# EAGLE design TempestShocker (EAGLE 6.6.0)

## Sheet 1 of 3
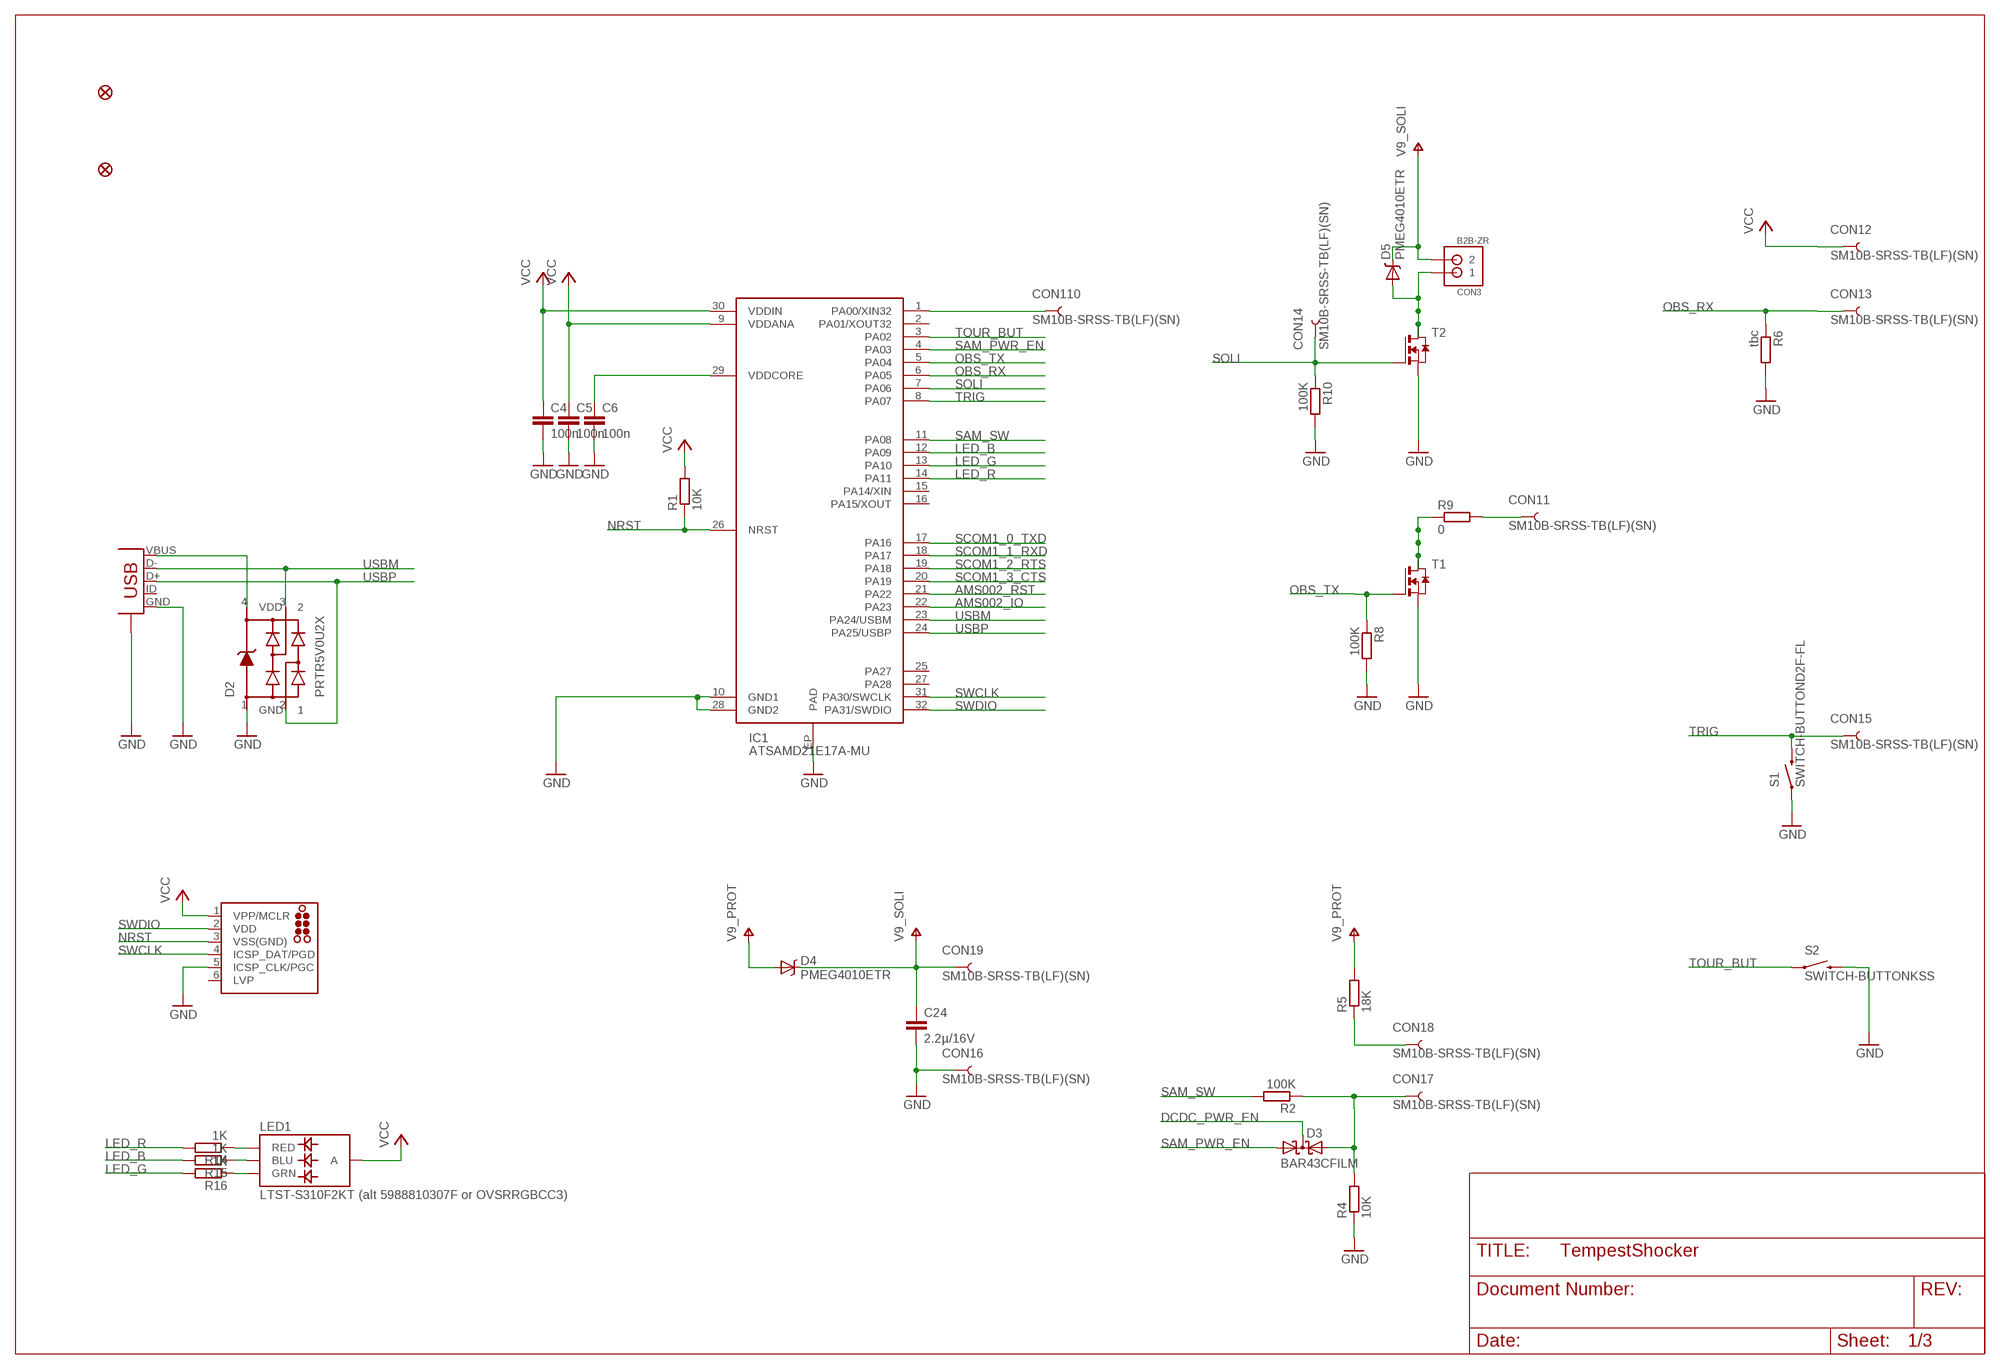
[diagram p0: schematic, sheet 1]

### Parts
C4  100n  C0603  [_0603MP]
C5  100n  C0603  [_0603MP]
C6  100n  C0603  [_0603MP]
C24  2.2µ/16V  C-EUC0805  [C0805]
CON1  SM10B-SRSS-TB(LF)(SN)  [SM10B-SRSS-TB]
CON3  B2B-ZR  [S2B-ZR]
CON4  USB-MICRO-A  [USB-MICROB]
D2  PRTR5V0U2X  WE-TVS_824011B  [AUTOPILOT_SOT143B]
D3  BAR43CFILM  BAT54C  [SOT23]
D4  PMEG4010ETR  DIODE-SCHOTTKYSOD123  [SOD123]
D5  PMEG4010ETR  DIODE-SCHOTTKYSOD123  [SOD123]
FID1  FIDUCIALUFIDUCIAL  [MICRO-FIDUCIAL]
FID6  FIDUCIALUFIDUCIAL  [MICRO-FIDUCIAL]
IC1  ATSAMD21E17A-MU  ATSAMD21E  [QFN-32]
LED1  LTST-S310F2KT (alt 5988810307F or OVSRRGBCC3)  LED-TRICOLORSMD_SIDE  [RGB-LED-SMD-SIDE]
R1  10K  R0603  [_0603MP]
R2  100K  R0603  [_0603MP]
R4  10K  R0603  [_0603MP]
R5  18K  R0603  [_0603MP]
R6  tbc  R0603  [_0603MP]
R8  100K  R0603  [_0603MP]
R9  0  R0603  [_0603MP]
R10  100K  R0603  [_0603MP]
R14  1K  R0603  [_0603MP]
R15  1K  R0603  [_0603MP]
R16  1K  R0603  [_0603MP]
S1  SWITCH-BUTTOND2F-FL  [D2F-FL]
S2  SWITCH-BUTTONKSS  [KSS]
T1  NMOSSOT23-6  [SOT23-6]
T2  NMOSSOT23-6  [SOT23-6]
TC2030-CTX-NL  dnp  TC2030-MCP-NL  [TC2030-MCP-NL]

### Nets
AMS002_IO: IC1.22(PA23) ; also sheet 2
AMS002_RST: IC1.21(PA22) ; also sheet 2
DCDC_PWR_EN: D3.3(CC) ; also sheet 3
GND: C4.2 C5.2 C6.2 C24.2 CON1.6 CON4.GND CON4.GND@1(GND) D2.1(GND) IC1.10(GND1) IC1.28(GND2) IC1.EP(PAD) R4.1 R6.2 R8.2 R10.2 S1.COM S2.2 T1.4(S) T2.4(S) TC2030-CTX-NL.5(ICSP_CLK/PGC) ; also sheet 2,3
LED_B: IC1.12(PA09) R15.2
LED_G: IC1.13(PA10) R16.2
LED_R: IC1.14(PA11) R14.2
N$1: CON1.10 IC1.1(PA00/XIN32)
N$2: C6.1 IC1.29(VDDCORE)
N$3: CON3.1 D5.A T2.1(D) T2.2(D1) T2.5(D2) T2.6(D3)
N$4: CON4.VBUS D2.4(VDD)
N$5: CON1.7 D3.2(A2) R2.1 R4.2
N$6: R9.1 T1.1(D) T1.2(D1) T1.5(D2) T1.6(D3)
N$7: CON1.8 R5.1
N$8: CON1.1 R9.2
N$30: LED1.1(RED) R14.1
N$31: LED1.3(BLU) R15.1
N$32: LED1.2(GRN) R16.1
NRST: IC1.26(NRST) R1.1 TC2030-CTX-NL.3(VSS(GND))
OBS_RX: CON1.3 IC1.6(PA05) R6.1
OBS_TX: IC1.5(PA04) R8.1 T1.3(G)
SAM_PWR_EN: D3.1(A1) IC1.4(PA03)
SAM_SW: IC1.11(PA08) R2.2
SCOM1_0_TXD: IC1.17(PA16) ; also sheet 2
SCOM1_1_RXD: IC1.18(PA17) ; also sheet 2
SCOM1_2_RTS: IC1.19(PA18) ; also sheet 2
SCOM1_3_CTS: IC1.20(PA19) ; also sheet 2
SOLI: CON1.4 IC1.7(PA06) R10.1 T2.3(G)
SWCLK: IC1.31(PA30/SWCLK) TC2030-CTX-NL.4(ICSP_DAT/PGD)
SWDIO: IC1.32(PA31/SWDIO) TC2030-CTX-NL.2(VDD)
TOUR_BUT: IC1.3(PA02) S2.1
TRIG: CON1.5 IC1.8(PA07) S1.NO
USBM: CON4.D- D2.3 IC1.23(PA24/USBM)
USBP: CON4.D+ D2.2 IC1.24(PA25/USBP)
V9_PROT: D4.A R5.2 ; also sheet 3
V9_SOLI: C24.1 CON1.9 CON3.2 D4.C D5.C
VCC: C4.1 C5.1 CON1.2 IC1.9(VDDANA) IC1.30(VDDIN) LED1.4(A) R1.2 TC2030-CTX-NL.1(VPP/MCLR) ; also sheet 2,3
Unconnected: CON4.ID IC1.2(PA01/XOUT32) IC1.15(PA14/XIN) IC1.16(PA15/XOUT) IC1.25(PA27) IC1.27(PA28) TC2030-CTX-NL.6(LVP)

## Sheet 2 of 3
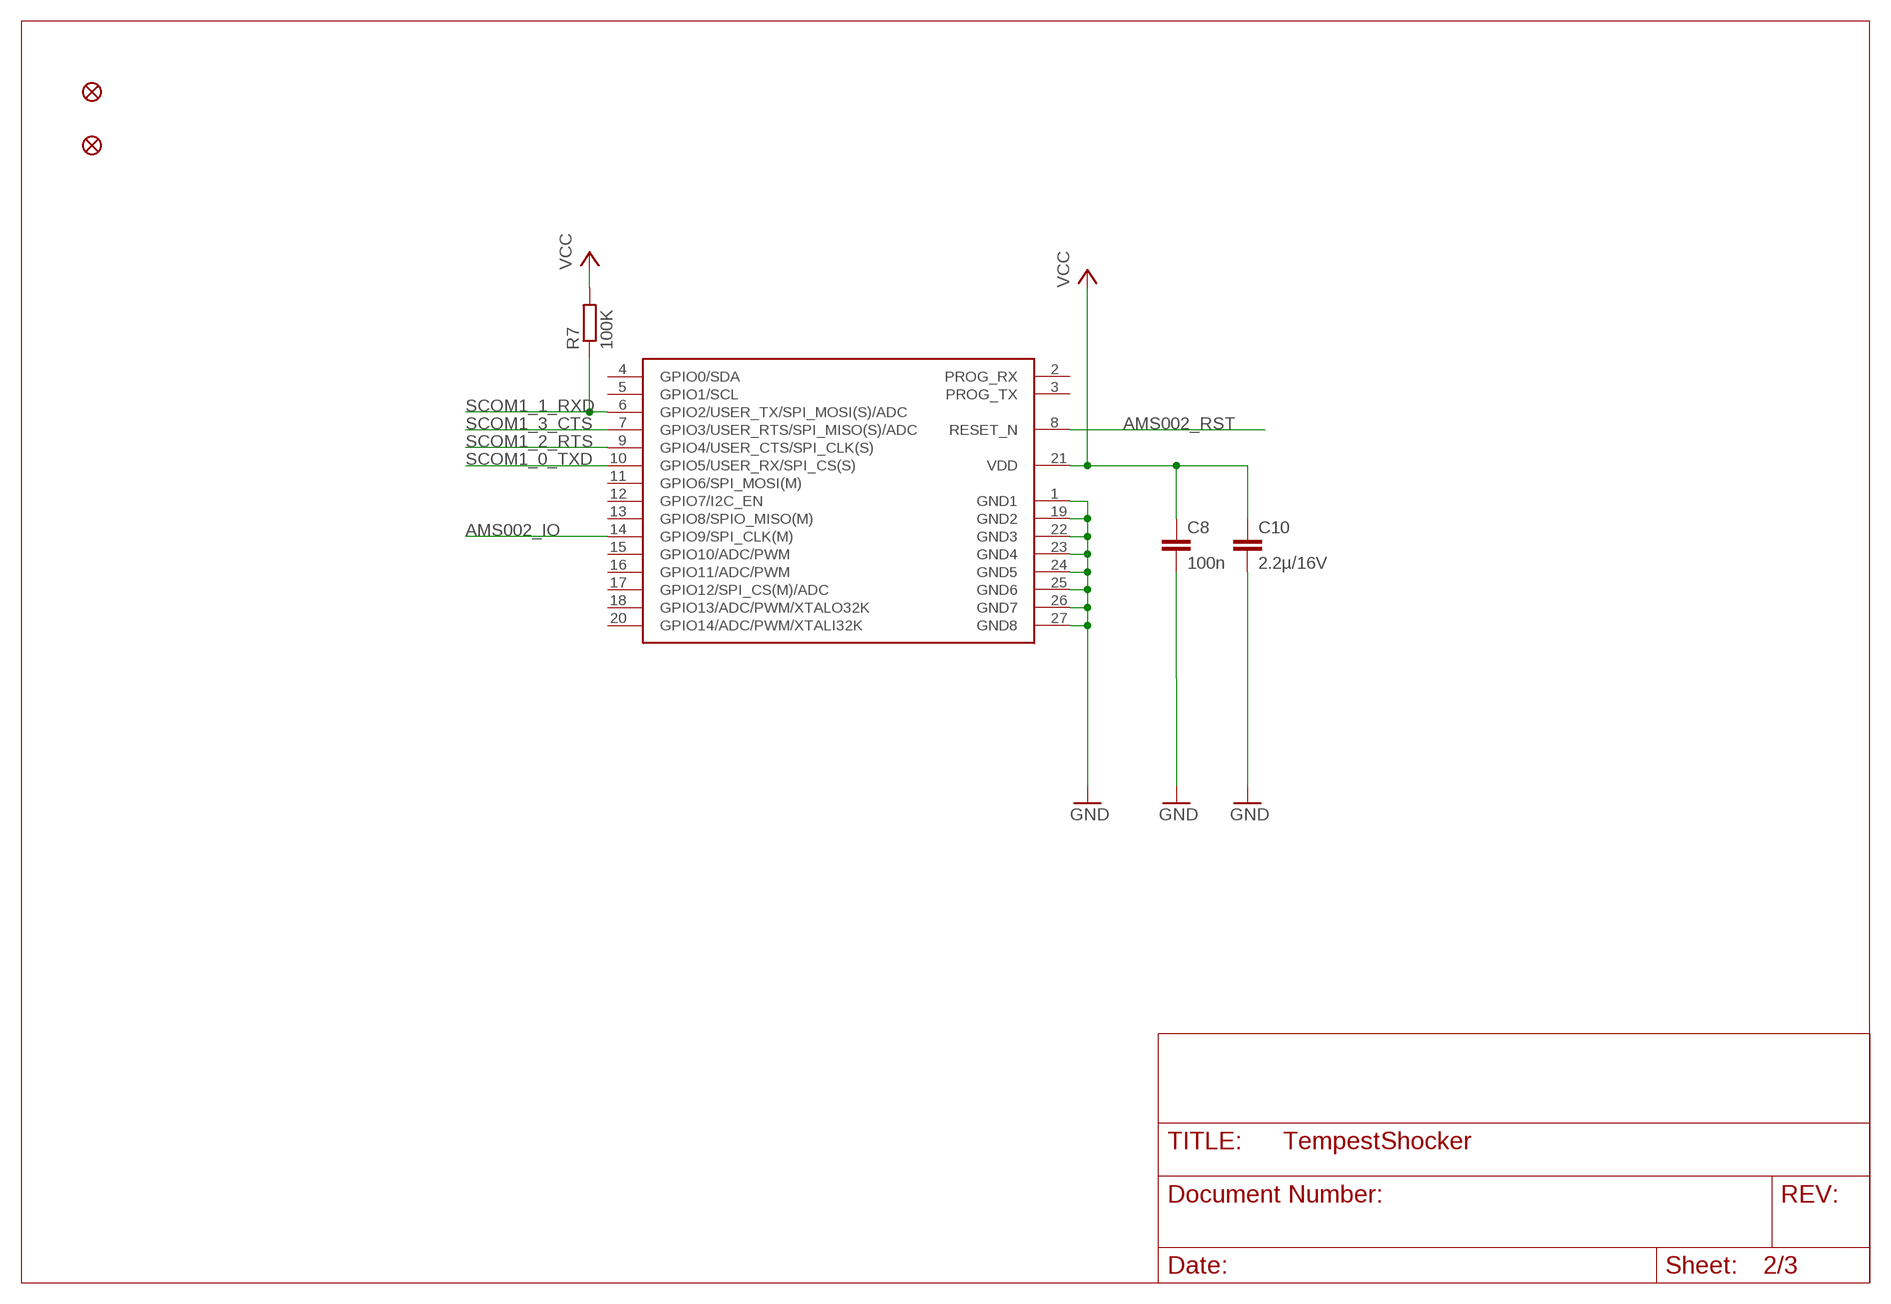
[diagram p1: schematic, sheet 2]

### Parts
C8  100n  C0603  [_0603MP]
C10  2.2µ/16V  C-EUC0805  [C0805]
FID3  FIDUCIALUFIDUCIAL  [MICRO-FIDUCIAL]
FID5  FIDUCIALUFIDUCIAL  [MICRO-FIDUCIAL]
R7  100K  R0603  [_0603MP]
U$1  AMS001/AMS002  AMS002  [AMS00X]

### Nets
AMS002_IO: U$1.14(GPIO9/SPI_CLK(M)) ; also sheet 1
AMS002_RST: U$1.8(RESET_N) ; also sheet 1
GND: C8.2 C10.2 U$1.1(GND1) U$1.19(GND2) U$1.22(GND3) U$1.23(GND4) U$1.24(GND5) U$1.25(GND6) U$1.26(GND7) U$1.27(GND8) ; also sheet 1,3
SCOM1_0_TXD: U$1.10(GPIO5/USER_RX/SPI_CS(S)) ; also sheet 1
SCOM1_1_RXD: R7.1 U$1.6(GPIO2/USER_TX/SPI_MOSI(S)/ADC) ; also sheet 1
SCOM1_2_RTS: U$1.9(GPIO4/USER_CTS/SPI_CLK(S)) ; also sheet 1
SCOM1_3_CTS: U$1.7(GPIO3/USER_RTS/SPI_MISO(S)/ADC) ; also sheet 1
VCC: C8.1 C10.1 R7.2 U$1.21(VDD) ; also sheet 1,3
Unconnected: U$1.2(PROG_RX) U$1.3(PROG_TX) U$1.4(GPIO0/SDA) U$1.5(GPIO1/SCL) U$1.11(GPIO6/SPI_MOSI(M)) U$1.12(GPIO7/I2C_EN) U$1.13(GPIO8/SPIO_MISO(M)) U$1.15(GPIO10/ADC/PWM) U$1.16(GPIO11/ADC/PWM) U$1.17(GPIO12/SPI_CS(M)/ADC) U$1.18(GPIO13/ADC/PWM/XTALO32K) U$1.20(GPIO14/ADC/PWM/XTALI32K)

## Sheet 3 of 3
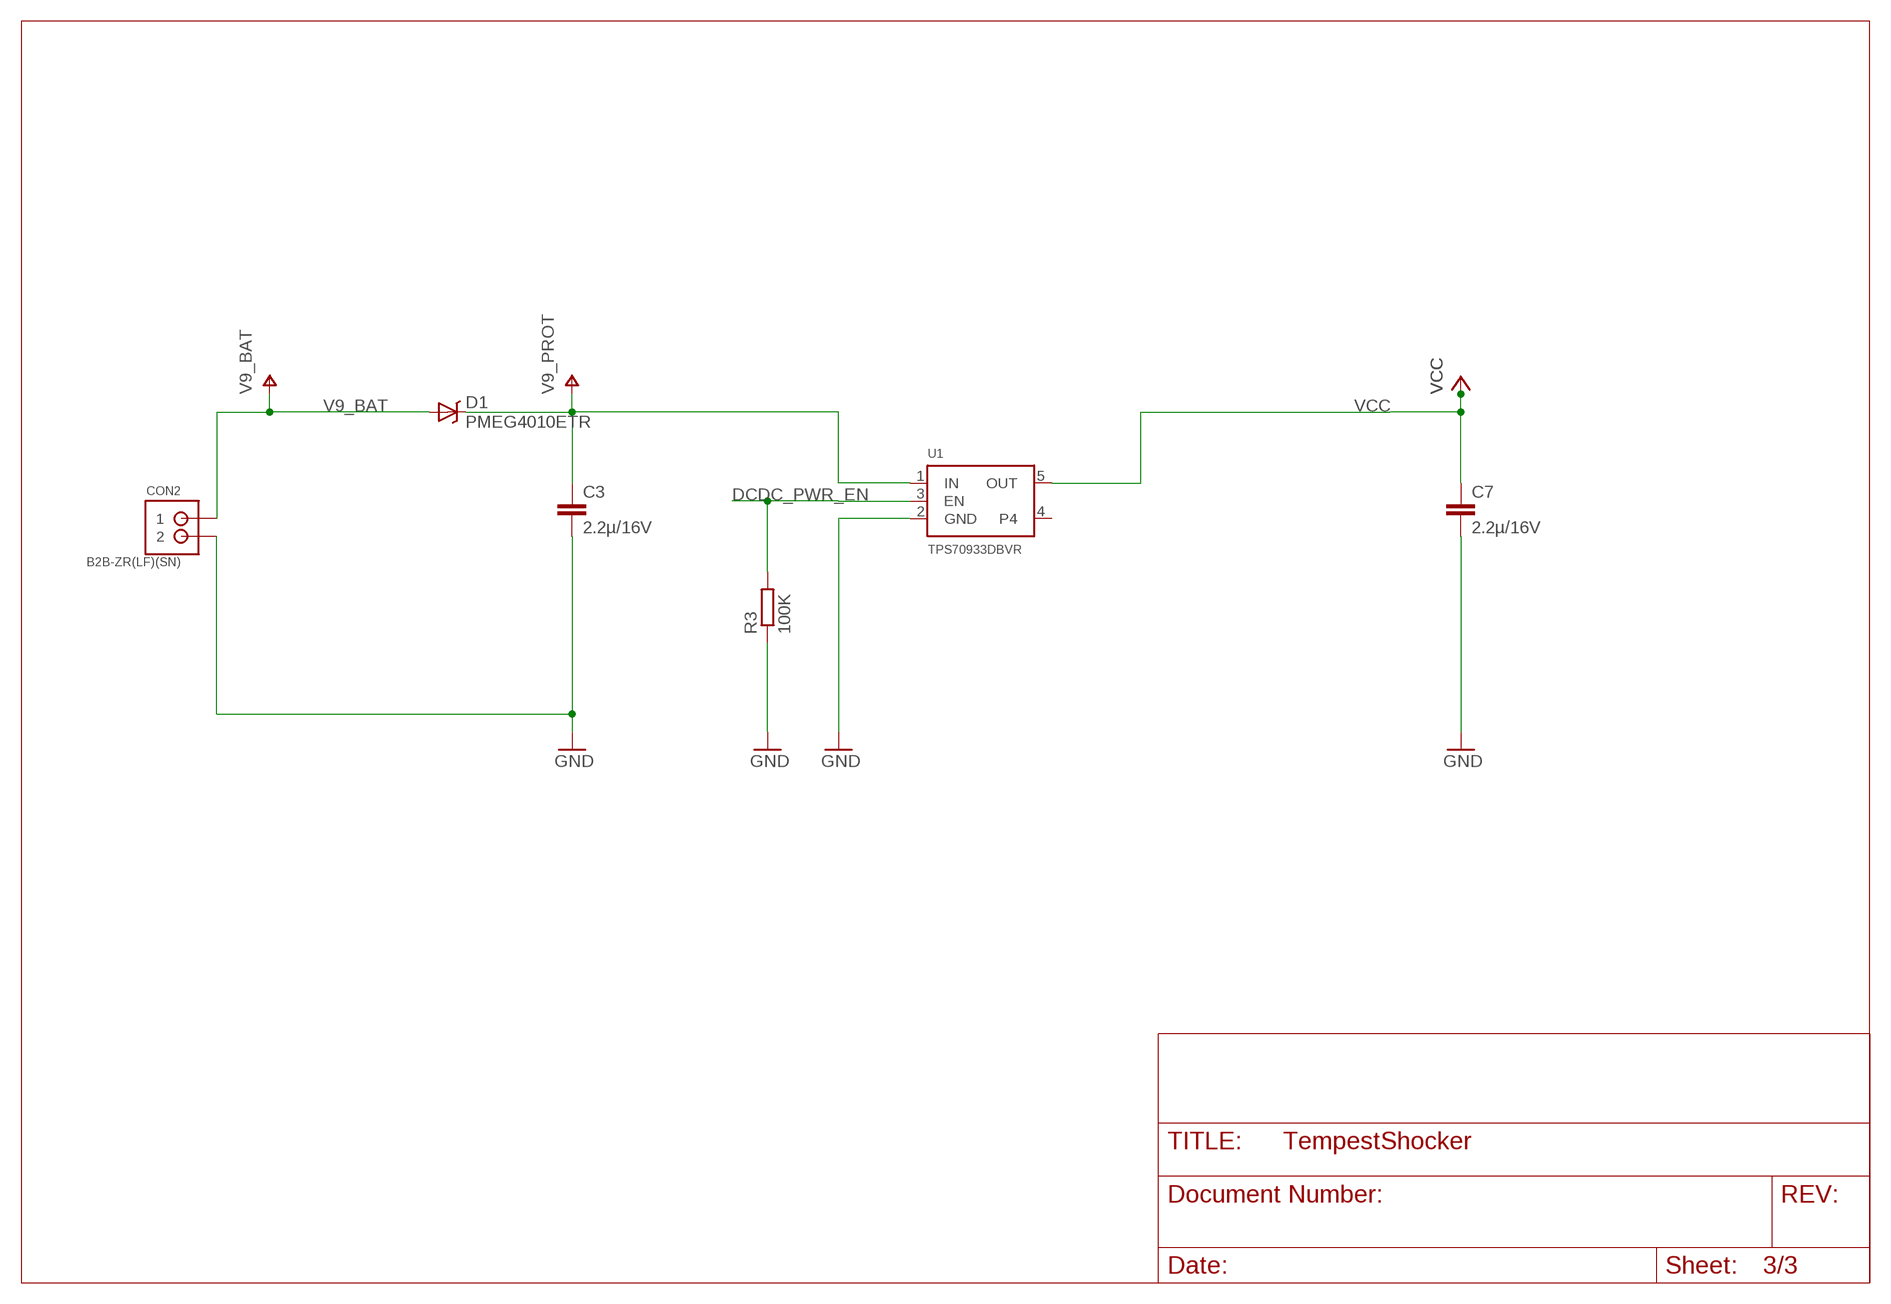
[diagram p2: schematic, sheet 3]

### Parts
C3  2.2µ/16V  C-EUC0805  [C0805]
C7  2.2µ/16V  C-EUC0805  [C0805]
CON2  B2B-ZR(LF)(SN)  B2B-ZR  [S2B-ZR]
D1  PMEG4010ETR  DIODE-SCHOTTKYSOD123  [SOD123]
R3  100K  R0603  [_0603MP]
U1  TPS70933DBVR  VREG_SOT23-5  [SOT23-5]

### Nets
DCDC_PWR_EN: R3.2 U1.3(EN) ; also sheet 1
GND: C3.2 C7.2 CON2.2 R3.1 U1.2(GND) ; also sheet 1,2
V9_BAT: CON2.1 D1.A
V9_PROT: C3.1 D1.C U1.1(IN) ; also sheet 1
VCC: C7.1 U1.5(OUT) ; also sheet 1,2
Unconnected: U1.4

## Power pins joined to a net without a drawn wire
GND: CON4.GND@2(GND) CON4.GND@3(GND) CON4.GND@4(GND) CON4.GND@5(GND) CON4.GND@6(GND)

## Library data of the parts
C3 C7 C10 C24 = squirrel:C-EU: CAPACITOR, European symbol
C4-C6 C8 = squirrel:C
CON1 = squirrel:SM10B-SRSS-TB(LF)(SN)
CON2 = squirrel:B2B-ZR; PART#: B2B-ZR(LF)(SN); SUPP: JST
CON3 = squirrel:B2B-ZR
CON4 = squirrel:USB-MICRO-A; PART#: ZX62-B-5PA(11); SUPP: Hirose
D1 D4 D5 = squirrel:DIODE-SCHOTTKY: Commonly MBRA140.
D2 = squirrel:WE-TVS_824011: TVS Diode Array WE-TVS, High Speed Series - Low capazity - No leakage current - Low clamping voltage - high ESD voltage protection -- USB 1.0 - 2.0; PART#: PRTR5V0U2X; SUPP: NXP
D3 = diode:BAT54C: Schottky Diodes Source: Fairchild .. BAT54.pdf
FID1 FID3 FID5 FID6 = squirrel:FIDUCIAL: Fiducial Alignment Points Various fiducial points for machine vision alignment.
IC1 = squirrel:ATSAMD21E; PART#: ATSAMD21E17A-MU; SUPP: Atmel
LED1 = squirrel:LED-TRICOLOR: Tri-Color LED SMD Proven layout and schematic for triple color LED in SMD package - common anode. Spark Fun Electronics SKU : COM-07844; PART#: LTST-S310F2KT; SUPP: Lite-On
R1-R10 R14-R16 = squirrel:R
S1 S2 = squirrel:SWITCH-BUTTON: Various NO switches- pushbuttons, reed, etc
T1 T2 = squirrel:NMOSSOT23-6: MOS FET
TC2030-CTX-NL = squirrel:TC2030: TAG-CONNECT ICSP Connector Manufacturer: Tag-Connect <http://www.tag-connect.com> Cable for easy In-Circuit Serial Programming. Designed for Microchip ICD2, suitable for many others. Two variants - one "with legs" (for hands-free fit on PCB) and another "without legs" for quick programming. PAD Description 1 MCLR/Vpp 2 Vdd 3 GND 4 PGD (ISPDAT) 5 PGC (ISPCLK) 6 nc (used for LVP) ©2009 ROFA.cz - modified and updated by Robert Darlington ‹rdarlington@gmail.com›
U1 = squirrel:VREG_SOT23-5: SOT23-5 Fixed Voltage Regulators Part Current Out V Out V In V Dropout ?JA (°C/W) TJ (°C) Digikey Part No. ADP121 150mA 3.3V 3.4-5.5V 0.09V @ 150mA -- -- ADP121-AUJZ33R7CT-ND ADP121 150mA 3.0V 3.1-5.5V 0.09V @ 150mA -- -- ADP121-AUJZ30R7CT-ND ADP122 300mA 3.3V 3.4-5.5V 0.085V @ 300mA -- -- ADP122AUJZ-3.3-R7CT-ND ADP1712 300mA 3.3V 3.5-5.5V 0.17V @ 300mA -- -- ADP1712AUJZ-3.3-R7TR-ND AP7311 (Low Cost) 150mA 3.3V 3.5-6V 0.15V @ 150mA -- -- AP7311-33WG-7DICT-ND LD39015M18R 150mA 1.8V 1.9V-5.5V 0.08V @ 100mA -- -- 497-6977-1-ND LP2985A-33DBVR 150mA 3.3V 3.3-16V 0.28V @ 150mA 206 150 296-18479-1-ND MCP1824T-3302E/OT 300mA 3.3V 3.5V-6V 0.2V @ 300mA -- -- MCP1824T-3302E/OTCT-ND MIC5205-2.5YM5 TR 150mA 2.5V 2.7-16V 0.165V @ 150mA -- -- 576-1257-2-ND MIC5205-3.0YM5 TR 150mA 3.0V 3.2V-16V 0.165V @ 150mA -- -- 576-1258-2-ND MIC5205-3.3YM5 TR 150mA 3.3V 3.5V-16V 0.165V @ 150mA -- -- 576-1259-2-ND TPS780330220 150mA 3.3V+2.2V 3.6-5.5V 250mV Max -- -- 296-23332-1-ND TDA3663/N1,135 100mA 3.3V 3.5-45V 0.18V @ 50mA -- -- 568-5343-1-ND Max operating temp can be calculated using ?JA, TJ (max junction temperature), and power in watts. Set the "Maximum Ambient Temperature" until it reaches TJ ("Max Junction Temperature"), which is the absolute limit for safe use of the regulator: Heat Sink Temperature Calculator <http://www.daycounter.com/Calculators/Heat-Sink-Temperature-Calculator.phtml> For example, With 12V source into a 3.3V LP2985 and a 30mA load, we are dissipating (12V-3.3V) * 0.03A = 0.261W. With a ?JA of 206 °C/W, a TJ of 150°C, and 261mW we can safely use the chip without a heat sink up to 75°C (=147.1°C Junction Temperature).; PART#: TPS70933DBVR; SUPP: TI
U$1 = AMS00x:AMS002; PART#: AMS001 or AMS002; SUPP: Zentri/ack.me

## Board
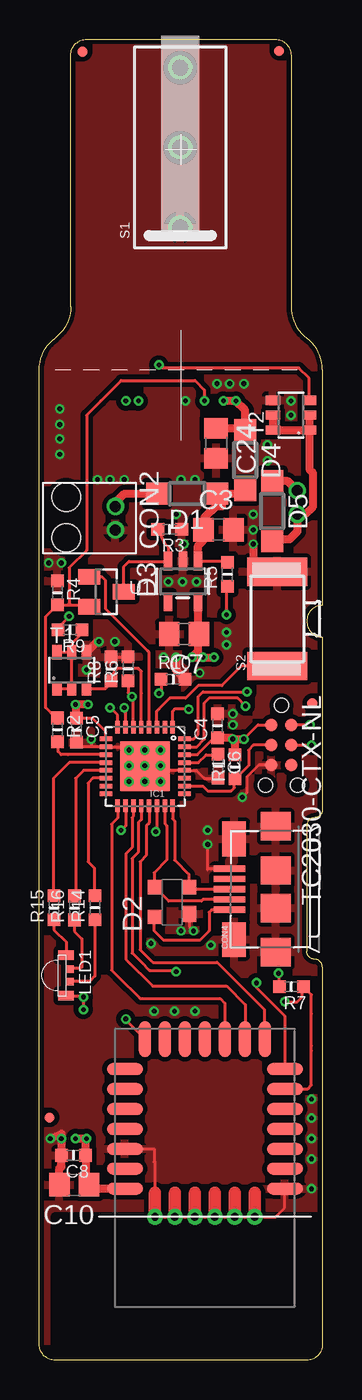
[diagram p3: board, top side]
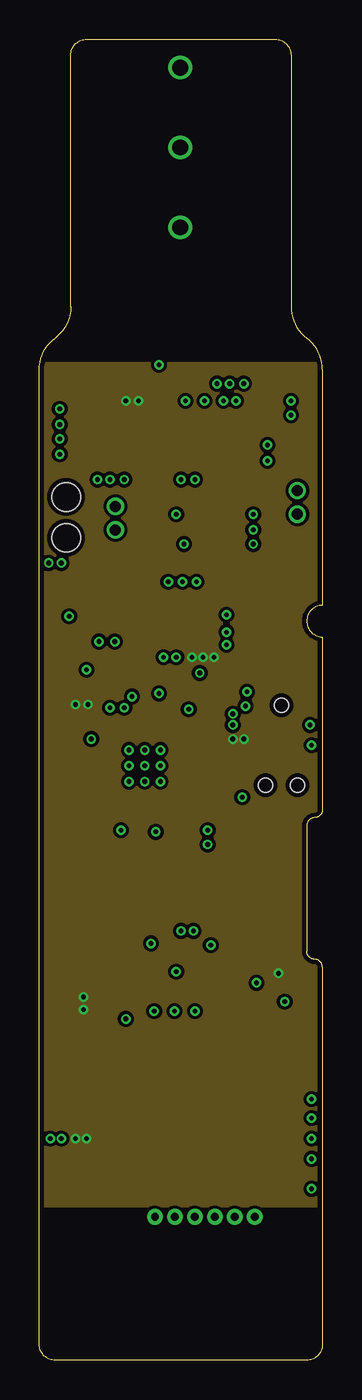
[diagram p4: board, inner layer Route2]
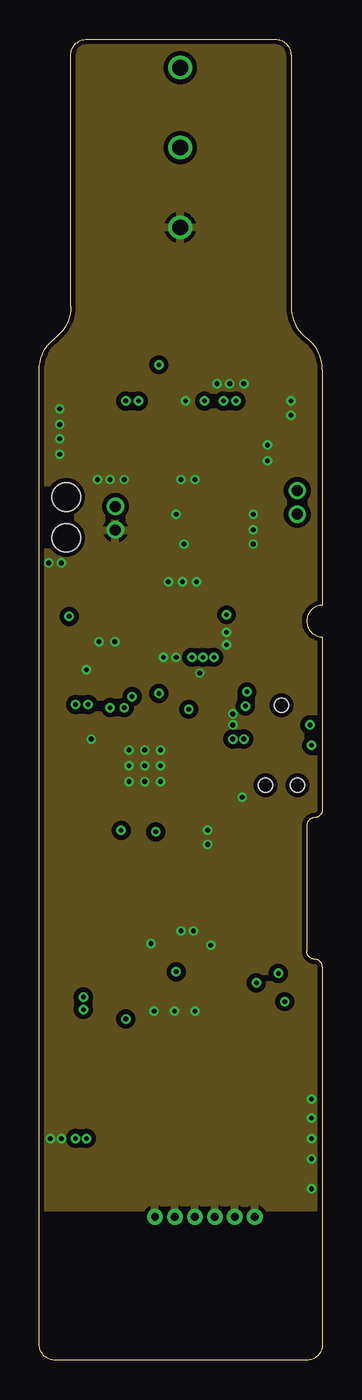
[diagram p5: board, inner layer Route15]
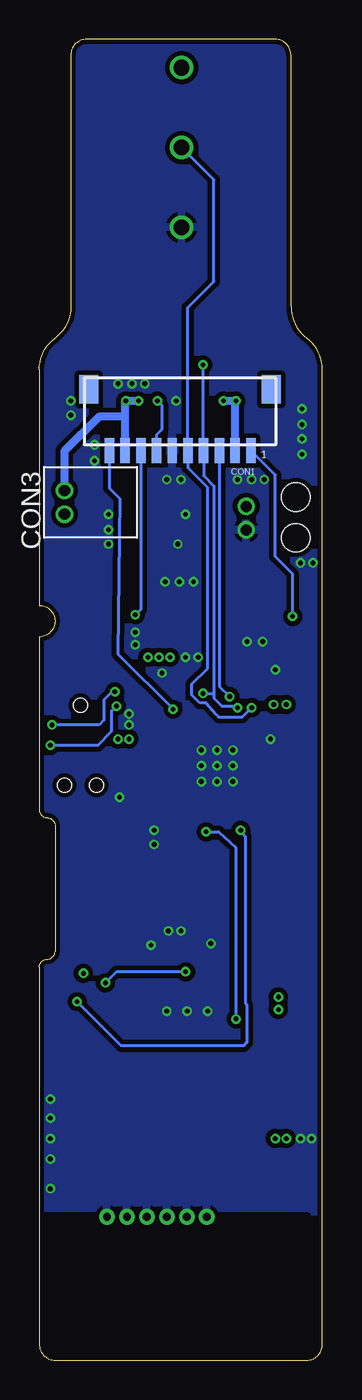
[diagram p6: board, bottom side, seen from below]

Size 18 x 84 mm. Coordinates in mm from the lower left corner, seen from the top.
Copper layers (1*2+15*16): Top 0.035mm / dielectric 0.45mm / Route2 0.035mm / dielectric 0.45mm / Route15 0.035mm / dielectric 0.45mm / Bottom 0.035mm
Design rules "pcbpool3": minimum track width 0.15mm, minimum drill 0.3mm, track to track 0.15mm, track to pad 0.15mm, pad to pad 0.15mm, via to via 0.15mm, smd to smd 0.15mm, copper to edge 0.3mm, drill to drill 8mil, minimum pad ring 0.2mm, minimum via ring 0.15mm, stop-mask expansion 4mil, vias tented up to drill 0mil, thermal gap 10mil
Holes 1.8 mm at 1.7,54.9 1.7,52.3
tRestrict: area 6,39.4 to 7.4,39.7; area 4.8,37.2 to 5.1,38.4; area 5.7,35.8 to 7.8,36.1; area 8.4,37.9 to 8.7,38.5; area 13.2,30.6 to 14,31.8

### Footprints (pad centres in the part's own frame; a part is rotated, then mirrored left to right if it is on the bottom)
C0805 = smd 1.3 x 1.5: 1 -0.95,0; 2 0.95,0
_0603MP = smd 0.8 x 0.8: 1 -0.762,0; 2 0.762,0
SM10B-SRSS-TB = smd 0.6 x 1.6: 1 -4.5,0; 2 -3.5,0; 3 -2.5,0; 4 -1.5,0; 5 -0.5,0; 6 0.5,0; 7 1.5,0; 8 2.5,0; 9 3.5,0; 10 4.5,0 | smd 1.2 x 1.8: MNT1 5.8,-3.9; MNT2 -5.8,-3.9
S2B-ZR = drill 0.7 pad 1.1: 1 0,-1.3; 2 1.5,-1.3
USB-MICROB = smd 0.4 x 2: D+ 0,2.9; D- -0.65,2.9; GND 1.3,2.9; ID 0.65,2.9; VBUS -1.3,2.9 | smd 1.8 x 1.9: GND@1 -1.2,-0.05; GND@2 -4,-0.05; GND@3 4,-0.05; GND@4 1.2,-0.05 | smd 2.2 x 1.5: GND@5 -3.2,2.6; GND@6 3.2,2.6
SOD123 = smd 1.4 x 1.4: A 1.9,0; C -1.9,0
AUTOPILOT_SOT143B = smd 1 x 0.9: 1 -0.75,-1.1 | smd 0.9 x 0.9: 2 0.95,-1.1; 3 0.95,1.1; 4 -0.95,1.1
SOT23 = smd 1 x 1.4: 1 -0.95,-1.1; 2 0.95,-1.1; 3 0,1.1
MICRO-FIDUCIAL = smd 0.635 x 0.635: 1 0,0
QFN-32 = smd 0.285 x 0.8: 1 -1.75,-2.5; 2 -1.25,-2.5; 3 -0.75,-2.5; 4 -0.25,-2.5; 5 0.25,-2.5; 6 0.75,-2.5; 7 1.25,-2.5; 8 1.75,-2.5; 17 1.75,2.5; 18 1.25,2.5; 19 0.75,2.5; 20 0.25,2.5; 21 -0.25,2.5; 22 -0.75,2.5; 23 -1.25,2.5; 24 -1.75,2.5 | smd 0.8 x 0.285: 9 2.5,-1.75; 10 2.5,-1.25; 11 2.5,-0.75; 12 2.5,-0.25; 13 2.5,0.25; 14 2.5,0.75; 15 2.5,1.25; 16 2.5,1.75; 25 -2.5,1.75; 26 -2.5,1.25; 27 -2.5,0.75; 28 -2.5,0.25; 29 -2.5,-0.25; 30 -2.5,-0.75; 31 -2.5,-1.25; 32 -2.5,-1.75 | smd 3.15 x 3.15: EP 0,0
RGB-LED-SMD-SIDE = smd 0.5 x 0.5: 1 0.55,-0.4; 2 0.55,0.4 | smd 1 x 0.6: 3 0.3,1.3; 4 0.3,-1.3
D2F-FL = drill 1: COM 0,-5.08; NC 0,5.08; NO 0,0
KSS = smd 1.8 x 3.8: 1 0.9,1.9; 2 6.9,1.9
SOT23-6 = smd 0.6 x 0.9: 1 -0.95,-1.15; 2 0,-1.15; 3 0.95,-1.15; 4 0.95,1.15; 5 0,1.15; 6 -0.95,1.15
TC2030-MCP-NL = smd 0.787 x 0.787: 1 1.27,-0.635; 2 1.27,0.635; 3 2.54,-0.635; 4 2.54,0.635; 5 3.81,-0.635; 6 3.81,0.635 | hole 0.889: 0,0; 5.08,-1.016; 5.08,1.016
SOT23-5 = smd 0.55 x 1.2: 1 -0.95,-1.3; 2 0,-1.3; 3 0.95,-1.3; 4 0.95,1.3; 5 -0.95,1.3
AMS00X = smd 0.762 x 2.286: 1 10.16,10.795; 2 8.89,10.795; 3 7.62,10.795; 4 6.35,10.795; 5 5.08,10.795; 6 3.81,10.795; 7 2.54,10.795; 15 2.54,0.635; 16 3.81,0.635; 17 5.08,0.635; 18 6.35,0.635; 19 7.62,0.635; 20 8.89,0.635; 21 10.16,0.635 | smd 2.286 x 0.762: 8 0.635,9.525; 9 0.635,8.255; 10 0.635,6.985; 11 0.635,5.715; 12 0.635,4.445; 13 0.635,3.175; 14 0.635,1.905 | drill 0.5 pad 1: 22 11.938,2.54; 23 11.938,3.81; 24 11.938,5.08; 25 11.938,6.35; 26 11.938,7.62; 27 11.938,8.89

### Placement (x,y rotation side)
C3  11.38,52.82 0 top
C4  11.33,40.35 90 top
C5  2.37,40.06 270 top
C6  11.37,37.77 270 top
C7  9.21,46.18 180 top
C8  2.18,13.03 180 top
C10  2.22,11.16 180 top
C24  11.24,58.31 270 top
CON1  9.05,57.84 180 bottom
CON2  6.14,54.3 270 top
CON3  17.7,53.8 90 bottom
CON4  14.98,29.95 90 top
D1  9.4,55.11 180 top
D2  8.44,29.13 90 top
D3  4.26,48.87 270 top
D4  13.09,57.24 270 top
D5  14.8,54 270 top
FID1  2.75,83.21 90 top
FID3  15.25,83.27 90 top
FID5  0.65,15.43 90 top
FID6  17.35,41.79 90 top
IC1  6.73,37.76 180 top
LED1  1.39,24.47 0 top
R1  12.45,37.73 90 top
R2  1.15,40.08 270 top
R3  8.29,52.85 180 top
R4  1.15,48.8 270 top
R5  11.95,49.99 90 top
R6  5.65,43.98 90 top
R7  16.03,23.75 180 top
R8  4.55,43.96 90 top
R9  1.95,46.45 180 top
R10  8.5,43.3 0 top
R14  3.53,28.78 90 top
R15  0.93,28.77 90 top
R16  2.23,28.76 90 top
S1  8.96,77.12 0 top
S2  17.03,43.24 90 top
T1  2.06,43.87 0 top
T2  16,60.1 90 top
TC2030-CTX-NL  15.39,41.65 270 top
U1  9.13,49.53 180 top
U$1  4.81,21.06 270 top
U$2  [SHOCKER-OUTLINE]  0,0 0 top

### Tracks (layer width: path | path; a pad name or v marks a point on that pad's centre or on a via)
AMS002_IO  (via drill 0.3)
  Top 0.2: IC1.22 7.48,33.68 v7.4,33.6 | v5.5,21.7 5.5,21.64 U$1.14
  Bottom 0.2: v7.4,33.6 6.6,33.6 5.5,32.6 v5.5,21.7
AMS002_RST
  Top 0.2: U$1.8 14.3,20.46 14.3,22.3 11.3,25.3 7.2,25.3 6.98,25.52 6.4,26.1 6.4,31.7 6.8,32.1 6.8,34 6.98,34.18 IC1.21
DCDC_PWR_EN
  Top 0.2: D3.3 5.36,50.46 5.7,50.8 8.15,50.8 U1.3 8.2,50.85 8.2,51.7 7.93,51.97 R3.2
GND  (via drill 0.3)
  Top 0.2: C6.2 11.16,37 10.5,37 9.99,37.51 IC1.28 7.81,37.51 | TC2030-CTX-NL.5 13.94,37.84 13.2,37.1 13.2,36.1 v12.9,35.8 | C5.2 2.66,39.01 IC1.10 5.49,39.01 | 5.49,39.01 5.5,39 | 7.81,37.51 7.8,37.5 | 5.49,39.01 5.49,39 IC1.EP 6.98,37.51 7.81,37.51 | R8.2 5.63,44.72 | D2.1 9.54,27.56 v9.8,27.3 | v3.3,39.5 3.3,39 | CON4.GND 10.75,31.25 10.7,31.2 v10.7,32.8 | U$1.19 7.3,13.44 7.3,12.6 7.35,12.6 U$1.22 U$1.23 U$1.24 U$1.25 U$1.26 U$1.27 15.02,9.12 15.6,9.7 U$1.1
  Top 0.5: C10.2 1.27,12.17 1.4,12.3 1.4,13.01 C8.2 1.4,13.05 1.4,14.4 v0.7,14.1 | v3.8,45.7 3.69,45.7 T1.4 | 5.63,44.72 R6.2 | v8.7,44.7 8.7,43.86 R10.2 | v13.6,51.9 13.6,50.2 13.9,50.2 15.07,50.2 S2.2
  other vias: 5.7,38.8 6.7,38.8 7.7,38.8 6.7,37.8 6.7,36.8 5.7,36.8 7.7,36.8 7.7,37.8 5.7,37.8 9.1,49.5 8.2,49.5 10,49.5 8.7,53.8 9.2,51.9 13.6,53.8 13.6,52.8 14.5,58.2 9.3,61 9,56 9.9,56 4.8,45.7 7.9,44.7 12.3,41.1 10.7,33.7 9,27.3 1.4,14.1 1.4,50.7 0.6,50.7 3,43.9 10.9,26.4 7.1,26.5 17.3,10.9 12.3,40.4 1.3,60.5 1.3,59.5 1.3,58.6 1.3,57.6 9.9,22.2 8.6,22.2 7.3,22.2 17.3,16.6 17.3,15.4 17.3,12.8 17.3,14.1 14.5,57.2 16,60.1 16,61 3.7,56 4.5,56 5.4,56 11.3,62.1 12.1,62.1 13,62.1 10.2,43.7 11.9,46.3 11.9,45.5
  pour Top (isolate 0.3): 0.2,0 0.3,0.7 0.1,84.3 18.4,84.3 18.7,0.2
  pour Bottom (isolate 0.3): -0.1,0.4 -0.6,0.4 -0.6,84.2 18.6,84.2 18.6,0 -0.1,0
  pour Route15 (isolate 0.3): -0.2,9.7 -0.4,84.3 18.3,84.3 18.3,9.7
LED_B
  Top 0.2: IC1.12 1.91,38.01 0.9,37 0.9,29.56 R15.2
LED_G
  Top 0.2: IC1.13 2.81,37.51 2.3,37 2.3,29.59 R16.2
LED_R
  Top 0.2: IC1.14 3.41,37.01 3.1,36.7 3.1,31.7 3.5,31.3 3.5,29.57 R14.2
N$1  (via drill 0.3)
  Top 0.2: v9.5,41.4 8.6,41.4 8.5,41.3 8.48,41.28 IC1.1
  Bottom 0.2: CON1.10 13.55,55.45 12.9,54.8 13,44.9 v9.5,41.4
N$2
  Top 0.2: IC1.29 10.11,38.01 10.6,38.5 11.14,38.5 C6.1
N$3
  Top 0.5: D5.A 15.2,52.2 15.9,52.2 16.4,52.7 CON3.1 16.9,53.8 17.4,54.3 17.4,56.4 17.2,56.6 17.2,59.1 T2.1 | T2.5 T2.6 T2.1 | T2.2 T2.1
N$4
  Top 0.2: CON4.VBUS 10.95,28.65 10.8,28.5 10.8,27.3 10.2,26.7 7.9,26.7 7.3,27.3 7.3,28.14 D2.4
N$5  (via drill 0.3)
  Top 0.2: R2.1 1.06,40.84 0.4,41.5 0.4,47.29 R4.2 2,48.04 | 2,48.04 3.04,48.04 D3.2 | 2,48.04 1.9,48.14 1.9,50.4 3,51.5 3,60.1 3.9,61 5.2,62.3 9.9,62.3 10.5,61.7 v10.5,61
  Bottom 0.2: CON1.7 10.55,58.85 10.2,59.2 10.2,60.7 v10.5,61
N$6
  Top 0.2: T1.1 T1.2 T1.5 | T1.6 T1.5 | R9.1 2.71,46.21 2.1,45.6 2.1,45.06 T1.5
N$7  (via drill 0.3)
  Top 0.2: v11.9,47.4 11.9,49.18 R5.1
  Bottom 0.2: CON1.8 11.55,47.75 v11.9,47.4
N$8  (via drill 0.3)
  Top 0.2: R9.2 1.19,46.59 v1.9,47.3
  Bottom 0.2: v1.9,47.3 1.9,50 3,51.1 3,56.29 CON1.1
N$30
  Top 0.2: R14.1 3.53,24.43 3.2,24.1 1.97,24.1 LED1.1
N$31
  Top 0.2: R15.1 0.93,27.37 1.7,26.6 LED1.3
N$32
  Top 0.2: R16.1 2.23,27.27 2.7,26.8 2.7,25 2.6,24.9 1.97,24.9 LED1.2
NRST
  Top 0.2: IC1.26 10.39,36.51 10.7,36.2 12.2,36.2 12.4,36.4 12.4,36.92 R1.1 13.3,37.82 13.3,38.8 13.61,39.11 TC2030-CTX-NL.3
OBS_RX  (via drill 0.3)
  Top 0.2: R6.1 5.65,42.45 v5.9,42.2 5.98,42.12 IC1.6
  Bottom 0.2: CON1.3 6.55,42.85 v5.9,42.2
OBS_TX
  Top 0.2: IC1.5 6.48,42.42 6.48,43.82 6.3,44 5,44 4.7,43.7 4.7,43.35 R8.1 4.5,43.15 4.5,43 4.22,42.72 T1.3
SAM_PWR_EN
  Top 0.2: D3.1 3.98,49.82 4.2,49.6 4.2,47.8 6.9,45.1 6.98,45.02 IC1.4
SAM_SW
  Top 0.2: IC1.11 1.81,38.51 1.39,38.51 1.2,38.7 1.2,39.27 R2.2
SCOM1_0_TXD
  Top 0.2: U$1.10 11.8,22.7 11.5,23 6.4,23 4.98,24.42 4.6,24.8 4.6,34.1 4.98,34.48 IC1.17
SCOM1_1_RXD  (via drill 0.3)
  Top 0.2: U$1.6 17.05,17.25 17.3,17.5 17.3,19.7 | 17.3,19.7 17.3,20 | 17.3,20 17.3,22.04 17.3,23.24 R7.1 16.7,23.66 16.7,23.1 16.4,22.8 v15.6,22.8 | IC1.18 5.48,33.98 v5.2,33.7 | 17.3,19.7 17.3,20
  Bottom 0.2: v5.2,33.7 4.9,33.3 4.9,22.7 4.8,22.6 4.8,20.2 5,20 12.8,20 v15.6,22.8
SCOM1_2_RTS
  Top 0.2: U$1.9 13.1,20.46 13.1,22.6 11.9,23.8 7.2,23.8 5.5,25.5 5.5,32.2 5.9,32.6 5.9,34.5 5.98,34.58 IC1.19
SCOM1_3_CTS  (via drill 0.3)
  Top 0.2: 14.6,22.9 14.85,22.65 | 14.85,22.65 15.6,21.9 U$1.7 | IC1.20 6.48,34.38 6.3,34.2 6.3,32.3 5.9,31.9 5.9,25.9 6.48,25.32 7,24.8 8.6,24.8 v8.7,24.7 | v13.8,24 13.8,23.7 14.85,22.65
  Bottom 0.2: v8.7,24.7 13.1,24.7 v13.8,24
SOLI  (via drill 0.3)
  Top 0.2: IC1.7 5.48,41.42 v5.4,41.5 | R10.1 7.74,42.54 v7.6,42.4 | T2.3 17.15,62.45 16.5,63.1 7.8,63.1 v7.6,63.3
  Bottom 0.2: 6.9,42.2 6.9,55.6 7.55,56.25 CON1.4 7.6,57.89 v7.6,63.3 | 6.9,42.2 6.9,42.1 6.6,41.8 6.4,41.6 5.5,41.6 v5.4,41.5 | v7.6,42.4 6.9,42.4 6.9,42.2
SWCLK  (via drill 0.3)
  Top 0.2: IC1.31 10.01,39.01 10.5,39.5 10.5,41.8 10.8,42.1 12.6,42.1 v13.1,41.6 | v17.3,39.1 TC2030-CTX-NL.4
  Bottom 0.2: v17.3,39.1 14.3,39.1 13.4,40 13.4,41.3 v13.1,41.6
SWDIO  (via drill 0.3)
  Top 0.2: IC1.32 9.81,39.51 10.1,39.8 10.1,42.2 10.4,42.5 v13.2,42.5 | v17.2,40.4 16.05,40.4 TC2030-CTX-NL.2
  Bottom 0.2: v13.2,42.5 13.4,42.5 13.9,42 13.9,40.7 14.2,40.4 v17.2,40.4
TOUR_BUT
  Top 0.2: S2.1 12.84,44.14 11.6,42.9 10.1,42.9 9.3,42.1 8.3,42.1 7.6,41.4 7.48,41.28 IC1.3
TRIG  (via drill 0.3)
  Top 0.2: IC1.8 4.98,41.02 v4.5,41.5
  Bottom 0.2: v4.5,41.5 5.1,40.9 6.6,40.9 6.8,41.1 7.4,41.8 7.8,41.8 8.3,42.3 8.3,43 7.3,44 7.3,55.5 8.55,56.75 CON1.5 8.55,66.95 6.9,68.6 6.9,75.06 S1.NO
USBM
  Top 0.2: CON4.D- 10.4,29.3 10.3,29.2 8.22,29.2 D2.3 7.3,30.12 7.3,31 8.1,31.8 8.1,34 7.98,34.12 IC1.23
USBP
  Top 0.2: CON4.D+ 9.67,29.95 D2.2 9.5,30.12 9.5,30.9 8.6,31.8 8.6,34.3 8.48,34.42 IC1.24
V9_BAT
  Top 0.5: CON2.1 4.84,54.54 5.4,55.1 7.79,55.1 D1.A
V9_PROT
  Top 0.2: U1.1 11.87,50.83 R5.2
  Top 0.5: U1.1 10.08,51.58 10.08,51.78 10.4,52.1 10.4,52.79 C3.1 10.5,52.89 10.5,53.6 11.2,54.3 11.6,54.3 D1.C 13.49,55.11 D4.A
V9_SOLI  (via drill 0.3)
  Top 0.2: 13.13,59.5 D4.C
  Top 0.5: v11.7,61 v12.5,61 13.09,60.41 D4.C 12.97,59.26 C24.1 | CON3.2 15.8,55.9 D5.C
  Bottom 0.2: 12.35,60.85 v11.7,61
  Bottom 0.5: v11.7,61 v12.5,61 12.55,60.95 12.55,60.2 | CON1.9 12.55,59.25 12.55,60.2 | CON3.2 16.4,57.8 14.2,60 12.6,60 12.6,60.15 12.55,60.2
VCC  (via drill 0.3)
  Top 0.2: IC1.30 10.05,38.51 11.13,39.59 C4.1 | IC1.9 4.23,39.97 3.4,40.8 2.69,40.8 C5.1 2.35,40.8 2.3,40.8 | 12.21,39.59 v12.3,39.5 | 12.45,39.35 v12.3,39.5 | v12.3,39.5 v13,39.5 13.9,40.4 14.73,40.4 TC2030-CTX-NL.1 | LED1.4 2.73,23.17 v2.8,23.1 v2.8,22.3 | R7.2 15.27,24.53 v15.2,24.6
  Top 0.5: U1.5 10.08,46.06 | 10.08,46.06 C7.1 | U$1.21 3.43,10.9 C10.1 2.94,11.39 C8.1 2.94,13.84 v3,14.1 v2.3,14.1 | 10.08,46.06 10.08,45.08 v9.7,44.7 v10.4,44.7 v11.1,44.7 | C4.1 12.21,39.59 | R1.2 12.45,39.35 | v12.3,39.5 v13,39.5 | v3.1,41.7 v2.3,41.7 2.3,40.8
  Bottom 0.5: v6.3,61 v5.5,61 5.55,60.95 CON1.2
  pour Route2 (isolate 0.2): -0.2,9.8 -0.2,63.4 18.2,63.4 18.1,9.8